# Altium project PMR_for_R124_test.PrjPcb (part 2 of 2)

## Sheet MCU.SchDoc
size A4; DocumentNumber: 6; SheetNumber: 6; SheetTotal: 7
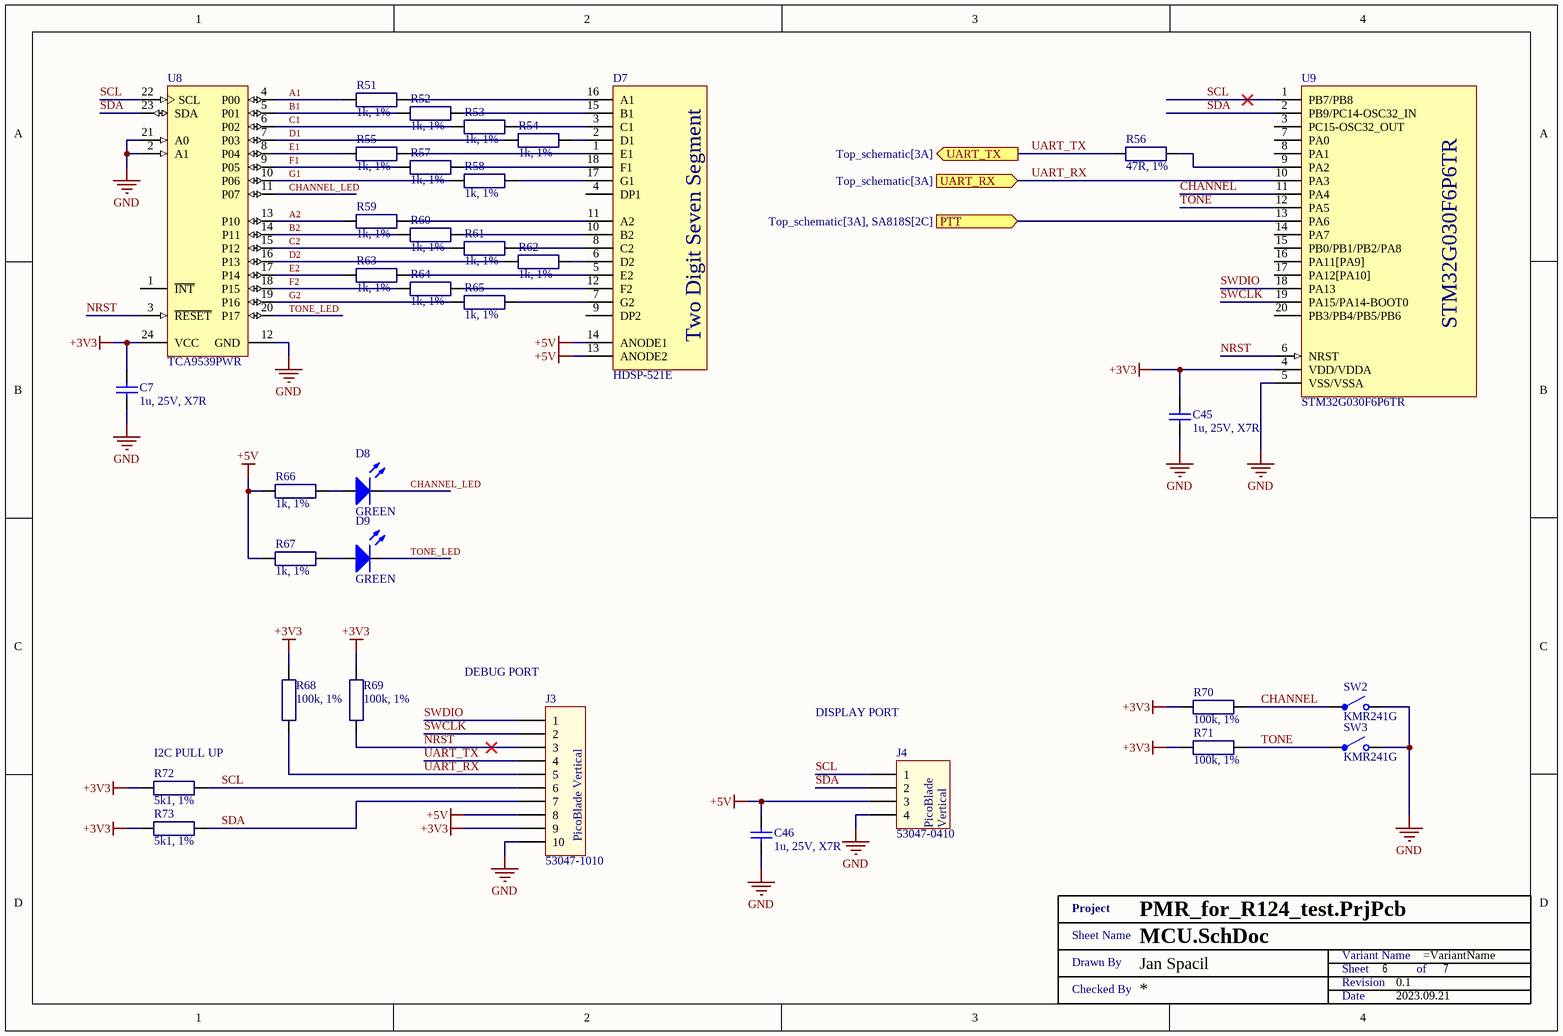
[diagram p3: MCU.SchDoc]

### Parts
(Parts that share a designator on the sheet are numbered #1, #2 ... from top to bottom, then left to right.)
C7  1u, 25V, X7R  [SMD0603]
C45  1u, 25V, X7R  [SMD0603]
C46  1u, 25V, X7R  [SMD0603]
D7  HDSP-521E  [HDSP-521E]
D8  GREEN  [MCL-S270]
D9  GREEN  [MCL-S270]
J3  53047-1010  [530471010]
J4  53047-0410  [530470410]
R51  1k, 1%  [SMD0603 - R]
R52  1k, 1%  [SMD0603 - R]
R53  1k, 1%  [SMD0603 - R]
R54  1k, 1%  [SMD0603 - R]
R55  1k, 1%  [SMD0603 - R]
R56  47R, 1%  [SMD0603 - R]
R57  1k, 1%  [SMD0603 - R]
R58  1k, 1%  [SMD0603 - R]
R59  1k, 1%  [SMD0603 - R]
R60  1k, 1%  [SMD0603 - R]
R61  1k, 1%  [SMD0603 - R]
R62  1k, 1%  [SMD0603 - R]
R63  1k, 1%  [SMD0603 - R]
R64  1k, 1%  [SMD0603 - R]
R65  1k, 1%  [SMD0603 - R]
R66  1k, 1%  [SMD0603 - R]
R67  1k, 1%  [SMD0603 - R]
R68  100k, 1%  [SMD0603 - R]
R69  100k, 1%  [SMD0603 - R]
R70  100k, 1%  [SMD0603 - R]
R71  100k, 1%  [SMD0603 - R]
R72  5k1, 1%  [SMD0603 - R]
R73  5k1, 1%  [SMD0603 - R]
SW2  KMR241G  [KMR2]
SW3  KMR241G  [KMR2]
U8  TCA9539PWR  [PW0024A_M]
U9  STM32G030F6P6TR  [TSSOP20]
XX?#4  Title 1  (value not drawn)  (graphical)

### Ports
PTT (in, see Top_schematic[3A], SA818S[2C]), UART_RX (in, see Top_schematic[3A]), UART_TX (out, see Top_schematic[3A])

### Nets
+3V3: C7.1 C45.1 J3.9 R68.2 R69.2 R70.2 R71.2 R72.2 R73.2 U8.24(VCC) U9.4(VDD/VDDA)
+5V: C46.1 D7.13(ANODE2) D7.14(ANODE1) J3.8 J4.3 R66.1 R67.1
GND: C7.2 C45.2 C46.2 J3.10 J4.4 SW2.2 SW3.2 U8.2(A1) U8.12(GND) U8.21(A0) U9.5(VSS/VSSA)
A1: R51.2 U8.4(P00)
A2: R59.2 U8.13(P10)
B1: R52.2 U8.5(P01)
B2: R60.2 U8.14(P11)
C1: R53.2 U8.6(P02)
C2: R61.2 U8.15(P12)
CHANNEL: R70.1 SW2.1 U9.11(PA4)
CHANNEL_LED: D8.2(K) U8.11(P07)
D1: R54.2 U8.7(P03)
D2: R62.2 U8.16(P13)
E1: R55.2 U8.8(P04)
E2: R63.2 U8.17(P14)
F1: R57.2 U8.9(P05)
F2: R64.2 U8.18(P15)
G1: R58.2 U8.10(P06)
G2: R65.2 U8.19(P16)
NRST: J3.3 R69.1 U8.3(~{RESET}) U9.6(NRST)
PTT: U9.13(PA6) ; port PTT
SCL: J3.6 J4.1 R72.1 U8.22(SCL) U9.1(PB7/PB8)
SDA: J3.7 J4.2 R73.1 U8.23(SDA) U9.2(PB9/PC14-OSC32_IN)
SWCLK: J3.2 U9.19(PA15/PA14-BOOT0)
SWDIO: J3.1 U9.18(PA13)
TONE: R71.1 SW3.1 U9.12(PA5)
TONE_LED: D9.2(K) U8.20(P17)
UART_RX: J3.5 R68.1 U9.10(PA3) ; port UART_RX
UART_TX: J3.4 R56.1 ; port UART_TX
NetD7_1: D7.1(E1) R55.1
NetD7_2: D7.2(D1) R54.1
NetD7_3: D7.3(C1) R53.1
NetD7_5: D7.5(E2) R63.1
NetD7_6: D7.6(D2) R62.1
NetD7_7: D7.7(G2) R65.1
NetD7_8: D7.8(C2) R61.1
NetD7_10: D7.10(B2) R60.1
NetD7_11: D7.11(A2) R59.1
NetD7_12: D7.12(F2) R64.1
NetD7_15: D7.15(B1) R52.1
NetD7_16: D7.16(A1) R51.1
NetD7_17: D7.17(G1) R58.1
NetD7_18: D7.18(F1) R57.1
NetD8_1: D8.1(A) R66.2
NetD9_1: D9.1(A) R67.2
NetR56_2: R56.2 U9.9(PA2)

Not connected (* = marked no-connect by the designer): D7 4(DP1) 9(DP2); U8 1(~{INT}); U9 3(PC15-OSC32_OUT) 7(PA0) 8(PA1) 14(PA7) 15(PB0/PB1/PB2/PA8) 16(PA11[PA9]) 17(PA12[PA10]) 20(PB3/PB4/PB5/PB6)

### Notes on the sheet
- (near J3) DEBUG PORT
- DISPLAY PORT
- (near R72) I2C PULL UP
- (in symbol 53047-0410) PicoBlade; Vertical
- (in symbol 53047-1010) PicoBlade Vertical
- (in symbol HDSP-521E) Two Digit Seven Segment
- (in symbol Title 1) Project; Sheet Name; Variant Name; Drawn By; Sheet; of; Revision; Checked By; Date

### Library data of the parts
C7 C45 C46 = CGA3E1X7R1E105K080AC: CAP CER 1UF 25V X7R 0603; Manufacturer: TDK Corporation; Tolerance: ±10%; Manufacturer Part Number: CGA3E1X7R1E105K080AC; RoHS: RoHS Compliant; Category: Capacitors; Stock 1: 109509; Pricing 1: 1=0.2, 10=0.135, 100=0.0686, 500=0.04696, 1000=0.04154 (USD); Packaging: Cut Tape (CT); Part Status: Active; Voltage - Rated: 25V; Temperature Coefficient: X7R; Operating Temperature: -55°C ~ 125°C; Features: -; Ratings: AEC-Q200; Applications: Automotive; Failure Rate: -; Mounting Type: Surface Mount, MLCC; Package / Case: 0603 (1608 Metric); Size / Dimension: 0.063" L x 0.032" W (1.60mm x 0.80mm); Height - Seated (Max): -; Thickness (Max): 0.035" (0.90mm); Lead Spacing: -; Lead Style: -; ComponentLink1URL: https://product.tdk.com/info/en/catalog/datasheets/mlcc_automotive_general_en.pdf; ComponentLink1Description: https://product.tdk.com/info/en/catalog/datasheets/mlcc_automotive_general_en.pdf; Capacitance: 1u; Supplier 1: Mouser; Supplier Part Number 1: 810-CGA3E1X7R1E105K; Supplier 2: Farnell; Supplier Part Number 2: 2346962; Supplier 3: Digi-Key; Supplier Part Number 3: 445-6931-1-ND
D7 = HDSP-521E: Displays Segmented Panel 2DIGIT 16LED Hi-Eff. Red CA 18-Pin DIP Tube; Manufacturer: Broadcom Avago; Forward Voltage: 2.05V; Luminous Intensity: 4mcd; Max Power Dissipation: 62.5mW; Forward Current: 20mA; Number of Characters: 2; Test Current: 10mA; Element Configuration: Common Anode; Wavelength: 628nm; Character Height: 18.6mm; Number of Elements: 16; Number of Segments: 14; Character Width: 7.8mm; Reverse Voltage: 5V; Viewing Area (height): 14.22mm; Supplier 1: Mouser; Supplier Part Number 1: 630-HDSP-521E; Manufacturer Part Number: HDSP-521E; RoHS: Yes; Category: LED Displays; Stock 1: 3408; Pricing 1: 1=2.84000, 10=1.90000, 50=1.90000, 100=1.47000, 1000=1.12000, 10000=1.09000 (USD); Mount: Through Hole; Case/Package: DIP; Number of Pins: 18; Color: Red; Min Operating Temperature: -35°C; Max Operating Temperature: 85°C; Packaging: Rail/Tube; Number of Positions: 2; Package Quantity: 200; Illumination Color: Red; Operating Supply Voltage: 2.05V; Power Consumption: 62.5mW; Dominant Wavelength: 628nm; Power Dissipation: 62.5mW; Series: -; Display Type: Segment; Length: 25mm; Width: 0.984inch; Height: 0.732inch; Depth: 18.6mm; Viewing Area Length: 7.8mm; Radiation Hardening: No; REACH SVHC: No SVHC; Lead Free: Lead Free; RoHS Compliant: Yes; Supplier 2: Farnell; Supplier Part Number 2: 1003314; Supplier 3: Digi-Key; Supplier Part Number 3: 516-1206-5-ND; Supplier 4: RSComponents; Supplier Part Number 4: 8305126
D8 D9 = MCL-S270GC: MULTICOMP - MCL-S270GC - LED, 0805, GREEN, 10MCD, 570NM; LED Mounting: SMD; Bulb Size: 1.25mm x 1.4; Forward Current If: 20; Forward Voltage: 2.1; Wavelength Typ: 570; Luminous Intensity: 10; Viewing Angle: 140°; Lens Shape: Rectangular; SVHC: No SVHC (17-Dec-2015); Forward Voltage VF Max: 2.6; LED / Lamp Size: 1.4mm x 1.25; LED Type: Standard; Luminous Intensity Max: 16; Luminous Intensity Min: 4.5; No. of Pins: 2; Peak Forward Current: 100; Peak Wavelength: 568; Reverse Protection Voltage: 5; Voltage Vf Min: 1.7; Voltage Vf Typ: 2.1V<!--FANDB--><div class="features-and-benefits-container"><div class="features-and-benefits-description"><span class="features-benefits-value">The MCL-S270GC is a green SMD LED made of GaP dice. This LED offers water clear rectangular lens and 260°C for 5 seconds lead soldering temperature range 1.6mm from body.</span></div><div class="features-and-benefits-list"><ul class="features-and-benefits-list-list"><li class="features-and-benefits-list-item">-40 to 85; Manufacturer: MULTICOMP; Manufacturer Part Number: MCL-S270GC; RoHS: YES; Stock 1: 80989; Pricing 1: 5=0,145, 25=0,136, 100=0,126, 250=0,0813, 500=0,0645, 2000=0,0559, 5000=0,0496, 20000=0,0434 (GBP); LED Colour: Green; Packaging: Cut Tape; Product Range: -; Automotive Qualification Standard: -; MSL: MSL 3 - 168 hours; Current Rating: 20; Dominant Wavelength: 570; Dominant Wavelength Typ: 570; Forward Current If Max: 20; Luminous Intensity Typ: 10; Operating Temperature Max: 85; Operating Temperature Min: -40; Operating Temperature Range: -40°C to +85; Storage Temperature Max: +100; Storage Temperature Min: -40; ComponentLink1URL: http://www.farnell.com/cad/53028.pdf; ComponentLink1Description: http://www.farnell.com/cad/53028.pdf; ComponentLink2URL: http://www.farnell.com/datasheets/1671537.pdf; ComponentLink2Description: http://www.farnell.com/datasheets/1671537.pdf; Supplier 1: Farnell; Supplier Part Number 1: 1581242; Supplier 2: Newark; Supplier Part Number 2: 14N9356
J3 = 53047-1010: 1.25mm Pitch, PicoBlade PCB Header, Single Row, Vertical, Through Hole, Tin Plating, Friction Lock, 10 Circuits, Tray, 2.30mm PC Tail Length; Manufacturer: Molex; Number of Contacts: 10; Max Voltage Rating (DC): 125.125kV; Max Voltage Rating (AC): 125V; Current Rating: 1A; Contact Resistance: 20MR; Insulation Resistance: 100MR; Glow Wire Compliant: Non-compliant; Connector Type: Blade Pin; Supplier 1: Mouser; Supplier Part Number 1: 538-53047-1010; Manufacturer Part Number: 53047-1010; Stock 1: 9729; Pricing 1: 1 = 0.50000, 10 = 0.48800, 50 = 0.48800, 100 = 0.37400, 1000 = 0.26800, 10000 = 0.21600 (USD); RoHS: Yes; Mount: Through Hole; Contact Plating: Tin; Contact Material: Bronze; Housing Color: White; Color: Natural; Housing Material: Nylon; Body Plating: Tin; Plating: Tin; Min Operating Temperature: -40°C; Max Operating Temperature: 85°C; Termination: Solder; Number of Rows: 1; Orientation: Vertical; Packaging: Tray; Number of Positions: 10; Package Quantity: 2000; Voltage Rating: 125V; Max Current Rating: 1A; Number of Poles: 10; Voltage Rating (AC): 125V; Contact Gender: Male; Working Voltage: 125V; Current: 1A; Voltage: 125V; Number of Circuits: 10; Voltage Rating (DC): 125V; Length: 14.25mm; Height: 4.2mm; Pitch: 1.25mm; Depth: 3.2mm; Lead Pitch: 1.25mm; Radiation Hardening: No; REACH SVHC: Unknown; Lead Free: Lead Free; Flammability Rating: UL94 V-0; ComponentLink1URL: https://datasheet.ciiva.com/5151/0530471010-pcb-headers-171035-5151940.pdf?src-supplier=Mouser; ComponentLink1Description: https://datasheet.ciiva.com/5151/0530471010-pcb-headers-171035-5151940.pdf?src-supplier=Mouser; ComponentLink2URL: https://datasheet.ciiva.com/30250/7280530471010-pcb-headers-30250345.pdf?src-supplier=Onlinecomponents.com; ComponentLink2Description: https://datasheet.ciiva.com/30250/7280530471010-pcb-headers-30250345.pdf?src-supplier=Onlinecomponents.com; ComponentLink3URL: https://datasheet.ciiva.com/11747/0900766b8024e2fd-11747087.pdf?src-supplier=RSComponents; ComponentLink3Description: https://datasheet.ciiva.com/11747/0900766b8024e2fd-11747087.pdf?src-supplier=RSComponents; ComponentLink4URL: https://datasheet.ciiva.com/19461/2033252-19461670.pdf?src-supplier=Jameco; ComponentLink4Description: https://datasheet.ciiva.com/19461/2033252-19461670.pdf?src-supplier=Jameco; ComponentLink5URL: https://datasheet.ciiva.com/10083/0530471010-pcb-headers-10083962.pdf?src-supplier=Avnet; ComponentLink5Description: https://datasheet.ciiva.com/10083/0530471010-pcb-headers-10083962.pdf?src-supplier=Avnet; ComponentLink6URL: https://datasheet.ciiva.com/20207/22-3930e-20207531.pdf?src-supplier=Rapid+Electronics; ComponentLink6Description: https://datasheet.ciiva.com/20207/22-3930e-20207531.pdf?src-supplier=Rapid+Electronics; Supplier 2: Arrow; Supplier Part Number 2: 53047-1010; Stock 2: 19420; Pricing 2: 1 = 0.41890, 10 = 0.39900, 100 = 0.30530, 500 = 0.27600, 1000 = 0.24010, 8000 = 0.20770, 1 = 0.56870, 10 = 0.52970, 100 = 0.36620, 500 = 0.31550, 1000 = 0.26830, 100 = 0.37250 (USD); Supplier 3: Digi-Key; Supplier Part Number 3: WM1739-ND; Stock 3: 4931; Pricing 3: 1 = 0.52000, 10 = 0.48900, 100 = 0.37470, 500 = 0.32580, 1000 = 0.26879, 8000 = 0.21992, 16000 = 0.21666 (USD); Supplier 4: Farnell; Supplier Part Number 4: 9733086; Stock 4: 12753; Supplier 5: Mouser; Supplier Part Number 5: 538-53047-0410; Category: Headers and Wire Housings; Stock 5: 7971; Pricing 5: 1=0,27000, 10=0,23400, 100=0,18000, 500=0,15400, 1000=0,13000, 5000=0,11200, 10000=0,10400 (USD); Contact Mating Length: 0.089inch; ComponentLink7URL: https://datasheet.ciiva.com/3934/87920530470410-pcb-headers-3934064.pdf?src-supplier=Arrow; ComponentLink7Description: https://datasheet.ciiva.com/3934/87920530470410-pcb-headers-3934064.pdf?src-supplier=Arrow
J4 = 53047-0410: 1.25mm Pitch, PicoBlade PCB Header, Single Row, Vertical, Through Hole, Tin Plating, Friction Lock, 4 Circuits, Tray, 2.30mm PC Tail Length; Manufacturer: Molex; Manufacturer Part Number: 0530470410; Number of Positions: 4; Max Voltage Rating (AC): 125V; Contact Resistance: 20mR; Connector Type: Blade Pin; RoHS: Yes; Category: Headers and Wire Housings; Stock 4: 7971; Pricing 4: 1=0,27000, 10=0,23400, 100=0,18000, 500=0,15400, 1000=0,13000, 5000=0,11200, 10000=0,10400 (USD); Mount: Through Hole; Housing Material: Nylon; Contact Plating: Tin; Contact Material: Bronze; Color: Natural; Housing Color: White; Min Operating Temperature: -40°C; Max Operating Temperature: 85°C; Termination: Solder; Number of Contacts: 4; Packaging: Tray; Number of Rows: 1; Orientation: Straight; Length: 6.75mm; Pitch: 1.25mm; Contact Mating Length: 0.089inch; Depth: 3.2mm; ComponentLink1URL: https://datasheet.ciiva.com/3934/87920530470410-pcb-headers-3934064.pdf?src-supplier=Arrow; ComponentLink1Description: https://datasheet.ciiva.com/3934/87920530470410-pcb-headers-3934064.pdf?src-supplier=Arrow; Supplier 1: Mouser; Supplier Part Number 1: 538-53047-0410; Supplier 2: Farnell; Supplier Part Number 2: 9733060; Supplier 3: Digi-Key; Supplier Part Number 3: WM1733-ND; Supplier 4: Avnet; Supplier Part Number 4: 0530470410
R51-R55 R57-R67 = MCWR06X1001FTL: MULTICOMP - MCWR06X1001FTL - RES, THICK FILM, 1K, 1%, 0.1W, 0603; Voltage Rating: 50; Resistor Case Style: 0603 [1608 Metric]; Power Rating: 100; Product Range: MCWR Series; Temperature Coefficient: ± 100; SVHC: No SVHC (07-Jul-2017)<!--FANDB--><div class="features-and-benefits-container"><div class="features-and-benefits-desc-container"><span class="features-and-benefits-container-desc">SMD Chip Resistor, Thick Film, 1 kohm, 50 V, 0603 [1608 Metric], 100 mW, ± 1; Manufacturer: MULTICOMP; Manufacturer Part Number: MCWR06X1001FTL; RoHS: Y-EX; Stock 1: 134740; Pricing 1: 10=0.0037, 100=0.0022, 500=0.0016, 1000=0.0012, 2500=0.001 (GBP); Resistance: 1k; Resistance Tolerance: ± 1%; Packaging: Cut Tape; Resistor Element Material: Thick Film; Automotive Qualification Standard: -; ComponentLink1URL: http://www.farnell.com/datasheets/1849611.pdf; ComponentLink1Description: http://www.farnell.com/datasheets/1849611.pdf; Supplier 1: Farnell; Supplier Part Number 1: 2447272; Supplier 2: Newark; Supplier Part Number 2: 94X1378
R56 = RC0603FR-0747RL: YAGEO - RC0603FR-0747RL - Surface Mount Chip Resistor, Thick Film, RC Series, 47 ohm, 100 mW, 1%, 50 V, 0603 [1608 Metric] RoHS Compliant: Yes; Power Rating: 100mW; Voltage Rating (DC): 50V; Temperature Coefficient: 100ppm/°C; Voltage Rating: 75V; Supplier 1: Mouser; Supplier Part Number 1: 603-RC0603FR-0747RL; Manufacturer: Yageo; Manufacturer Part Number: RC0603FR-0747RL; RoHS: Yes; Category: Chip SMD Resistors; Stock 1: 314282; Pricing 1: 1=0.10000, 10=0.01800, 100=0.00600, 1000=0.00500, 5000=0.00300, 10000=0.00300 (USD); Case/Package: 0603; Number of Pins: 2; Weight: 7.1E-05oz; Case Code (Imperial): 0603; Case Code (Metric): 1608; Min Operating Temperature: -55°C; Max Operating Temperature: 155°C; Resistance: 47R; Tolerance: 1%; Packaging: Tape and Reel; Package Quantity: 1; Termination: SMD/SMT; Resistor Type: Thick Film; Number of Terminations: 2; Max Power Dissipation: 100mW; Features: Moisture Resistant; Length: 1.6mm; Height: 0.45mm; Width: 0.8mm; Depth: 0.8mm; REACH SVHC: Unknown; Lead Free: Lead Free; Military Standard: Not; ComponentLink1URL: https://datasheet.ciiva.com/2453/pyu-r-int-thick-7-2453922.pdf?src-supplier=Digi-Key; ComponentLink1Description: https://datasheet.ciiva.com/2453/pyu-r-int-thick-7-2453922.pdf?src-supplier=Digi-Key; ComponentLink2URL: https://datasheet.ciiva.com/2453/pyu-r-int-thick-7-2453923.pdf?src-supplier=Digi-Key; ComponentLink2Description: https://datasheet.ciiva.com/2453/pyu-r-int-thick-7-2453923.pdf?src-supplier=Digi-Key; ComponentLink3URL: https://datasheet.ciiva.com/2453/pyu-r-int-thick-7-2453924.pdf?src-supplier=Digi-Key; ComponentLink3Description: https://datasheet.ciiva.com/2453/pyu-r-int-thick-7-2453924.pdf?src-supplier=Digi-Key; ComponentLink4URL: https://datasheet.ciiva.com/7746/443971-7746363.pdf?src-supplier=Element14; ComponentLink4Description: https://datasheet.ciiva.com/7746/443971-7746363.pdf?src-supplier=Element14; ComponentLink5URL: https://datasheet.ciiva.com/7746/443971-7746364.pdf?src-supplier=Element14; ComponentLink5Description: https://datasheet.ciiva.com/7746/443971-7746364.pdf?src-supplier=Element14; ComponentLink6URL: https://datasheet.ciiva.com/46440/1868787-46440908.pdf?src-supplier=Element14; ComponentLink6Description: https://datasheet.ciiva.com/46440/1868787-46440908.pdf?src-supplier=Element14; Supplier 2: Farnell; Supplier Part Number 2: 9238328; Supplier 3: Digi-Key; Supplier Part Number 3: 311-47.0HRCT-ND
R68-R71 = RC0603FR-07100KL: RES SMD 100K OHM 1% 1/10W 0603; Manufacturer: Yageo; Power (Watts): 0.1W, 1/10W; Temperature Coefficient: ±100ppm/°C; Manufacturer Part Number: RC0603FR-07100KL; RoHS: RoHS Compliant; Category: Resistors; Stock 1: 14618646; Pricing 1: 1=0.1, 10=0.015, 100=0.006, 1000=0.00268, 2500=0.00233 (USD); Packaging: Cut Tape (CT); Part Status: Active; Tolerance: ±1%; Composition: Thick Film; Features: Moisture Resistant; Operating Temperature: -55°C ~ 155°C; Package / Case: 0603 (1608 Metric); Supplier Device Package: 0603; Size / Dimension: 0.063" L x 0.032" W (1.60mm x 0.80mm); Height - Seated (Max): 0.022" (0.55mm); Failure Rate: -; ComponentLink1URL: http://www.yageo.com/documents/recent/PYu-RC_Group_51_RoHS_L_8.pdf; ComponentLink1Description: http://www.yageo.com/documents/recent/PYu-RC_Group_51_RoHS_L_8.pdf; Resistance: 100k; Supplier 1: Mouser; Supplier Part Number 1: 603-RC0603FR-07100KL; Supplier 2: Farnell; Supplier Part Number 2: 9238727; Supplier 3: Digi-Key; Supplier Part Number 3: 311-100KHRCT-ND
R72 R73 = RC0603FR-075K1L: RES SMD 5.1K OHM 1% 1/10W 0603; Manufacturer: Yageo; Power Rating: 100mW; Temperature Coefficient: 100ppm/°C; Voltage Rating: 50V; Supplier 1: Mouser; Supplier Part Number 1: 603-RC0603FR-075K1L; Manufacturer Part Number: RC0603FR-075K1L; RoHS: Yes; Category: Chip SMD Resistors; Stock 1: 489882; Pricing 1: 1=0,10000, 10=0,01800, 50=0,01800, 100=0,00600, 1000=0,00500, 10000=0,00300 (USD); Case/Package: 0603; Number of Pins: 2; Case Code (Imperial): 0603; Case Code (Metric): 1608; Size Code: 0603; Min Operating Temperature: -55°C; Max Operating Temperature: 155°C; Tolerance: 1%; Series: RC; Resistance: 5k1; Packaging: Tape and Reel; Package Quantity: 1; Termination: SMD/SMT; Resistor Type: Thick Film; Number of Terminations: 2; Max Power Dissipation: 100mW; Voltage Rating (DC): 50V; Features: Moisture Resistant; Resistance Tolerance: 1%; Construction: Rectangular; Length: 0.063inch; Width: 0.031inch; Height: 0.022inch; Depth: 0.8mm; RoHS Compliant: Yes; REACH SVHC: No SVHC; Military Standard: Not; Lead Free: Lead Free; ComponentLink1URL: https://datasheet.ciiva.com/46395/443971-46395016.pdf?src-supplier=Element14; ComponentLink1Description: https://datasheet.ciiva.com/46395/443971-46395016.pdf?src-supplier=Element14; ComponentLink2URL: https://datasheet.ciiva.com/15189/getdatasheetpartid-326732-15189786.pdf?src-supplier=Verical; ComponentLink2Description: https://datasheet.ciiva.com/15189/getdatasheetpartid-326732-15189786.pdf?src-supplier=Verical; ComponentLink3URL: https://datasheet.ciiva.com/2454/pyu-r-int-thick-7-2454045.pdf?src-supplier=Digi-Key; ComponentLink3Description: https://datasheet.ciiva.com/2454/pyu-r-int-thick-7-2454045.pdf?src-supplier=Digi-Key; ComponentLink4URL: https://datasheet.ciiva.com/2454/pyu-r-int-thick-7-2454046.pdf?src-supplier=Digi-Key; ComponentLink4Description: https://datasheet.ciiva.com/2454/pyu-r-int-thick-7-2454046.pdf?src-supplier=Digi-Key; ComponentLink5URL: https://datasheet.ciiva.com/2454/pyu-r-int-thick-7-2454047.pdf?src-supplier=Digi-Key; ComponentLink5Description: https://datasheet.ciiva.com/2454/pyu-r-int-thick-7-2454047.pdf?src-supplier=Digi-Key; Supplier 2: Farnell; Supplier Part Number 2: 3495881; Supplier 3: Digi-Key; Supplier Part Number 3: 311-5.10KHRCT-ND
SW2 SW3 = KMR241G LFS: C & K COMPONENTS - KMR241G LFS - SWITCH, SMD, 4N, 0.05A, 32VDC, SPST-NO; Illumination: Non Illuminated; Contact Voltage DC Nom: 32; Contact Current Max: 50; Operating Force: 4; Switch Terminals: Solder; SVHC: No SVHC (17-Dec-2015); Actuation Type: Top; Actuator / Cap Colour: Black; Contact Resistance: 100; External Depth: 2.8; External Length / Height: 1.9; External Width: 4.6; Power Rating: 1VA<!--FANDB--><div class="features-and-benefits-container"><div class="features-and-benefits-description"><span class="features-benefits-value">The KMR241G LFS is a micro-miniature SMD Tactile Switch with momentary action and SPST-NO contact arrangement. It has silver-plated gull-wing terminals and grounding pin.</span></div><div class="features-and-benefits-list"><ul class="features-and-benefits-list-list"><li class="features-and-benefits-list-item">Top actuated</li><li class="features-and-benefits-list-item">Excellent tactile feel</li><li class="features-and-benefits-list-item">Ultra low current capabilities</li><li class="features-and-benefits-list-item">300000-cycle Operating life</li><li class="features-and-benefits-list-item">IP40 Protection rating</li></ul></div><div class="features-and-benefits-applications"><ul class="features-and-benefits-value"><li class="features-and-benefits-list-item">Automotive</li><li class="features-and-benefits-list-item">Industrial</li><li class="features-and-benefits-list-item">Medical</li><li class="features-and-benefits-list-item">Portable Devices</li></ul></div></div>; Manufacturer: C & K COMPONENTS; Manufacturer Part Number: KMR241G LFS; RoHS: YES; Stock 1: 40256; Pricing 1: 1=0.384, 50=0.37, 100=0.218, 7000=0.185, 20000=0.181, 30000=0.178, 50000=0.174 (GBP); Product Range: -; Contact Configuration: SPST-NO; Operating Temperature Max: 85; Operating Temperature Min: -40; ComponentLink1URL: http://www.farnell.com/datasheets/1702857.pdf; ComponentLink1Description: http://www.farnell.com/datasheets/1702857.pdf; Supplier 1: Mouser; Supplier Part Number 1: 611-KMR241GLFS; Supplier 2: Farnell; Supplier Part Number 2: 1437637; Supplier 3: Digi-Key; Supplier Part Number 3: CKN10248DKR-ND
U8 = CMP-0314-00251-2: Remote 16-Bit I2C and SMBus, Low-Power I/O Expander with Interrupt Output, Reset & Config. Register, 1.65 to 5.5 V, -40 to 85 degC, 24-pin TSSOP (PW), Green (RoHS & no Sb/Br); Manufacturer: Texas Instruments; Interrupt Output: Yes; SubFamily: I2C IO Expander; I2C Address: 1110 1xx; # of I/Os: 16; Max Frequency(kHz): 400; 5V Tolerant I/O: Yes; ComponentLink1Description: Datasheet; PartNumber: TCA9539PWR; Eco-Plan: Green (RoHS & no Sb/Br); Reset Input: Yes; ComponentLink2Description: Package Specification; Mounting Technology: Surface Mount; PackageReference: PW0024A; DatasheetVersion: SCPS202A; ComponentLink1URL: http://www.ti.com/general/docs/lit/getliterature.tsp?genericPartNumber=TCA9539&fileType=pdf; Vcc range(V): 1.65 to 5.5; Low Power: Yes; Code_JEDEC: MO-153; Configuration Registers: Yes; PackageVersion: revG, Feb-2011; PackageDescription: 24-Pin Thin Small Outline Package 0.65 mm Pitch; Push-Pull I/O Type: Yes; ComponentLink2URL: http://www.ti.com/litv/pdf/mpds177g
U9 = STM32G030F6P6TR: MCU 32-Bit STM32 ARM Cortex-M0+ RISC 32KB Flash 2V to 3.6V 20-Pin TSSOP T/R; Manufacturer: STMicroelectronics; Supplier 1: Mouser; Supplier Part Number 1: 511-STM32G030F6P6TR; Manufacturer Part Number: STM32G030F6P6TR; RoHS: Yes; Category: Microcontrollers; Stock 1: 3310; Pricing 1: 1=1.84000, 10=1.66000, 50=1.66000, 100=1.29000, 250=1.21000, 500=1.07000, 1000=0.84100, 2500=0.78400, 5000=0.74700, 10000=0.74700 (USD); Supplier 2: Digi-Key; Supplier Part Number 2: 497-STM32G030F6P6TRCT-ND

## Sheet Interfaces.SchDoc
size A4; DocumentNumber: 7; SheetNumber: 7; SheetTotal: 7
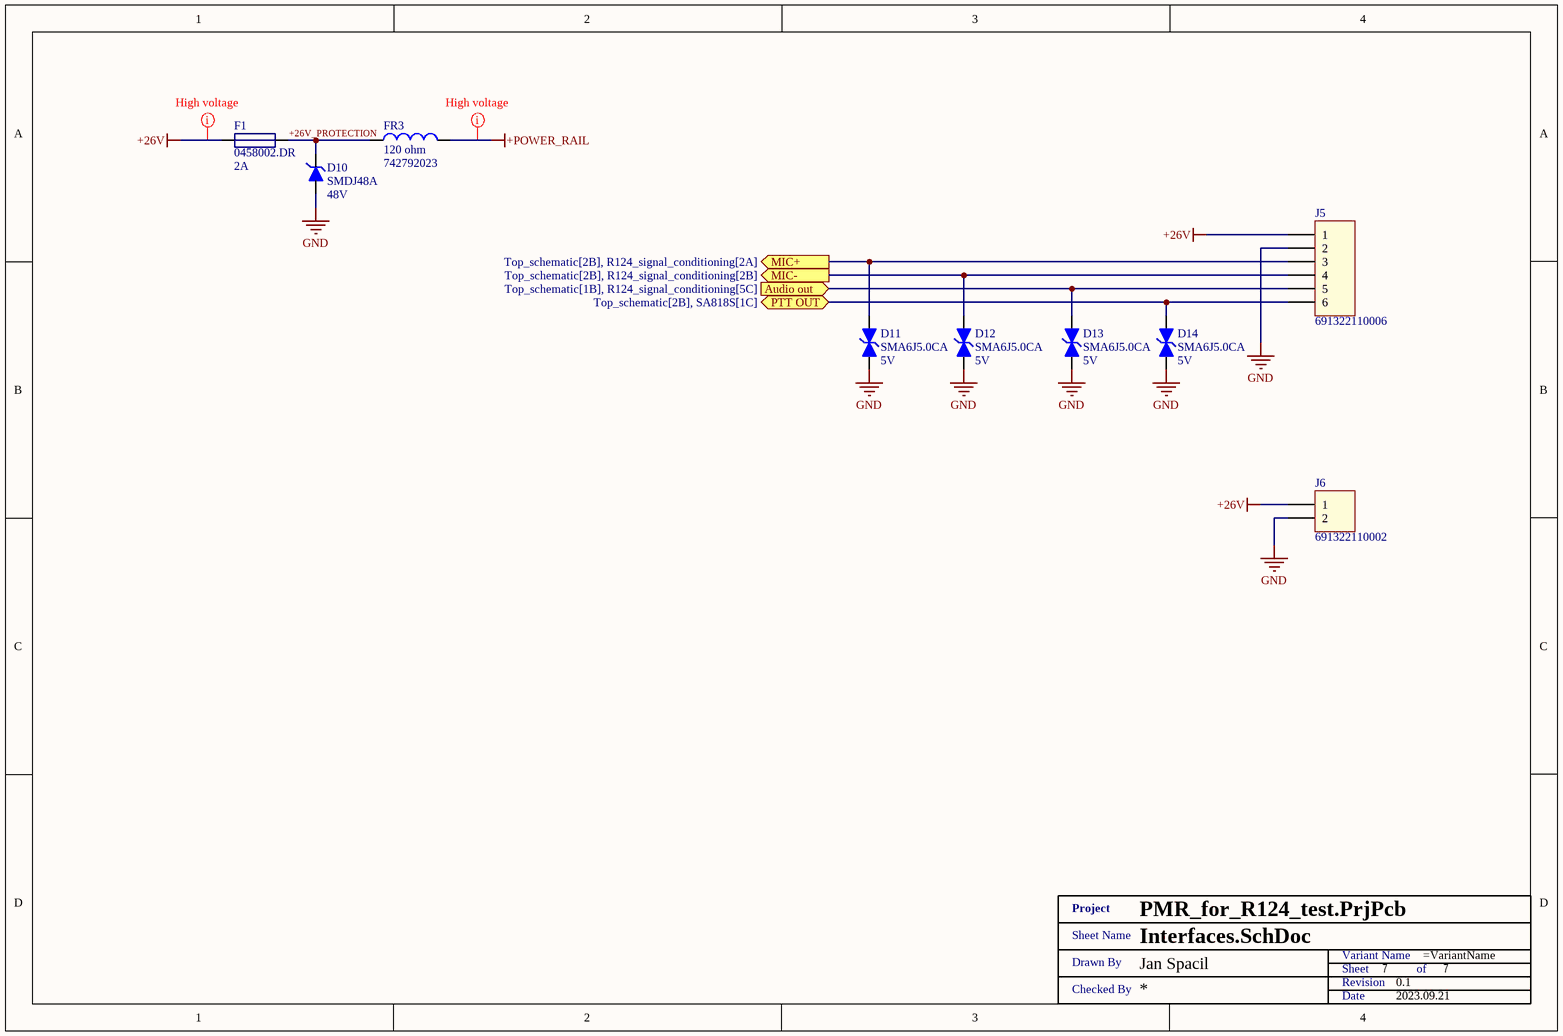
[diagram p4: Interfaces.SchDoc]

### Parts
(Parts that share a designator on the sheet are numbered #1, #2 ... from top to bottom, then left to right.)
D10  SMDJ48A  Reverse Standoff Voltage: 48V  [DO-214AB]
D11  SMA6J5.0CA  Reverse Standoff Voltage: 5V  [DO-214AC]
D12  SMA6J5.0CA  Reverse Standoff Voltage: 5V  [DO-214AC]
D13  SMA6J5.0CA  Reverse Standoff Voltage: 5V  [DO-214AC]
D14  SMA6J5.0CA  Reverse Standoff Voltage: 5V  [DO-214AC]
F1  0458002.DR  Current Rating: 2A  [SMD1206 - FUSE]
FR3  120 ohm  [SMD0805 - R]
J5  691322110006  [691322110006]
J6  691322110002  [691322110002]
XX?#5  Title 1  (value not drawn)  (graphical)

### Ports
Audio out (in, see Top_schematic[1B], R124_signal_conditioning[5C]), MIC+ (out, see Top_schematic[2B], R124_signal_conditioning[2A]), MIC- (out, see Top_schematic[2B], R124_signal_conditioning[2B]), PTT OUT (bidir, see Top_schematic[2B], SA818S[1C])

### Nets
+26V: F1.1 J5.1 J6.1
+POWER_RAIL: FR3.2
GND: D10.2 D11.1(A) D12.1(A) D13.1(A) D14.1(A) J5.2 J6.2
+26V_PROTECTION: D10.1 F1.2 FR3.1
AUDIO OUT: D13.2(K) J5.5 ; port Audio out
MIC+: D11.2(K) J5.3 ; port MIC+
MIC-: D12.2(K) J5.4 ; port MIC-
PTT OUT: D14.2(K) J5.6 ; port PTT OUT

### Layout directives
net class HV: +26V, +POWER_RAIL

### Notes on the sheet
- (in symbol Title 1) Project; Sheet Name; Variant Name; Drawn By; Sheet; of; Revision; Checked By; Date

### Library data of the parts
D10 = SMDJ48A: J Series 53.3 V 3000 W Surface Mount Uni-Directional TVS Diode - DO-214AB; Manufacturer: Littelfuse; Supplier 1: Mouser; Supplier Part Number 1: 576-SMDJ48A; Manufacturer Part Number: SMDJ48A; RoHS: Yes; Category: TVS Diodes; Stock 1: 11613; Pricing 1: 1=1.02, 10=0.889, 50=0.889, 100=0.688, 1000=0.471, 10000=0.408 (USD); ComponentLink1URL: https://datasheet.ciiva.com/16487/littelfuse-tvs-diodes-smdj-16487926.pdf?src-supplier=Future+Electronics; ComponentLink1Description: https://datasheet.ciiva.com/16487/littelfuse-tvs-diodes-smdj-16487926.pdf?src-supplier=Future+Electronics; ComponentLink2URL: https://datasheet.ciiva.com/332/littelfuse-tvs-diode-smdj-datasheet-pdf-332813.pdf?src-supplier=Digi-Key; ComponentLink2Description: https://datasheet.ciiva.com/332/littelfuse-tvs-diode-smdj-datasheet-pdf-332813.pdf?src-supplier=Digi-Key; ComponentLink3URL: https://datasheet.ciiva.com/332/littelfuse-tvs-diode-smdj-datasheet-pdf-332814.pdf?src-supplier=Digi-Key; ComponentLink3Description: https://datasheet.ciiva.com/332/littelfuse-tvs-diode-smdj-datasheet-pdf-332814.pdf?src-supplier=Digi-Key; ComponentLink4URL: https://datasheet.ciiva.com/332/littelfuse-tvs-diode-smdj-datasheet-pdf-332815.pdf?src-supplier=Digi-Key; ComponentLink4Description: https://datasheet.ciiva.com/332/littelfuse-tvs-diode-smdj-datasheet-pdf-332815.pdf?src-supplier=Digi-Key; Supplier 2: Farnell; Supplier Part Number 2: 2762843; Supplier 3: Digi-Key; Supplier Part Number 3: SMDJ48ACT-ND
D11-D14 = SMA6J5.0CA: ESD Suppressors / TVS Diodes 600W 5V 5% Bi-Directional; Manufacturer: Littelfuse; Supplier 1: Mouser; Supplier Part Number 1: 576-SMA6J5.0CA; Manufacturer Part Number: SMA6J5.0CA; RoHS: Yes; Category: TVS Diodes; Stock 1: 57321; Pricing 1: 1=0.41, 10=0.35, 50=0.35, 100=0.243, 1000=0.139, 10000=0.115 (USD); ComponentLink1URL: http://www.farnell.com/datasheets/2736094.pdf?src-supplier=Farnell; ComponentLink1Description: http://www.farnell.com/datasheets/2736094.pdf?src-supplier=Farnell; ComponentLink2URL: https://datasheet.octopart.com/SMA6J5.0CA-Littelfuse-datasheet-114785799.pdf?src-supplier=Future+Electronics; ComponentLink2Description: https://datasheet.octopart.com/SMA6J5.0CA-Littelfuse-datasheet-114785799.pdf?src-supplier=Future+Electronics; ComponentLink3URL: https://www.littelfuse.com/~/media/electronics/datasheets/tvs_diodes/littelfuse_tvs_diode_sma6j_datasheet.pdf.pdf?src-supplier=Digi-Key; ComponentLink3Description: https://www.littelfuse.com/~/media/electronics/datasheets/tvs_diodes/littelfuse_tvs_diode_sma6j_datasheet.pdf.pdf?src-supplier=Digi-Key; ComponentLink4URL: http://www.farnell.com/datasheets/2736094.pdf?src-supplier=Newark; ComponentLink4Description: http://www.farnell.com/datasheets/2736094.pdf?src-supplier=Newark; ComponentLink5URL: http://www.farnell.com/datasheets/2736094.pdf?src-supplier=Element14; ComponentLink5Description: http://www.farnell.com/datasheets/2736094.pdf?src-supplier=Element14; Supplier 2: Farnell; Supplier Part Number 2: 3010381; Supplier 3: Digi-Key; Supplier Part Number 3: 18-SMA6J5.0CACT-ND
F1 = 0458002.DR: FUSE BRD MNT 2A 48VAC 75VDC 1206; Manufacturer: Littelfuse; Body Material: Ceramic; Voltage Rating (AC): 48V; Voltage Rating (DC): 75V; Resistance: 69.5mR; DC Cold Resistance: 63.5mR; Fuse Type: Board Mount (Cartridge Style Excluded); Voltage Rating: 63V; Approvals: cULus; Supplier 1: Mouser; Supplier Part Number 1: 576-0458002.DR; Manufacturer Part Number: 0458002.DR; Stock 1: 11466; Pricing 1: 1 = 1.31000, 10 = 0.97500, 50 = 0.97500, 100 = 0.81200, 1000 = 0.67000, 10000 = 0.50800 (USD); RoHS: Yes; Mount: Surface Mount; Case/Package: 1206; Case Code (Metric): 3216; Case Code (Imperial): 1206; Housing Material: Ceramic; Min Operating Temperature: -55°C; Max Operating Temperature: 125°C; Packaging: Tape and Reel; Package Quantity: 1500; Fuse Current: 2A; Termination: SMD/SMT; Working Voltage: 63V; Length: 0.125inch; Height: 0.062inch; Width: 1.575mm; Depth: 1.58mm; REACH SVHC: No SVHC; Lead Free: Lead Free; ComponentLink1URL: https://datasheet.ciiva.com/1730/337915-1730544.pdf?src-supplier=Newark; ComponentLink1Description: https://datasheet.ciiva.com/1730/337915-1730544.pdf?src-supplier=Newark; ComponentLink2URL: https://datasheet.ciiva.com/299/littelfuse-fuse-458-series-299804.pdf?src-supplier=Digi-Key; ComponentLink2Description: https://datasheet.ciiva.com/299/littelfuse-fuse-458-series-299804.pdf?src-supplier=Digi-Key; ComponentLink3URL: https://datasheet.ciiva.com/299/littelfuse-fuse-458-series-299805.pdf?src-supplier=Digi-Key; ComponentLink3Description: https://datasheet.ciiva.com/299/littelfuse-fuse-458-series-299805.pdf?src-supplier=Digi-Key; ComponentLink4URL: https://datasheet.ciiva.com/299/littelfuse-fuse-458-series-299806.pdf?src-supplier=Digi-Key; ComponentLink4Description: https://datasheet.ciiva.com/299/littelfuse-fuse-458-series-299806.pdf?src-supplier=Digi-Key; Supplier 2: Farnell; Supplier Part Number 2: 1702533; Stock 2: 1620; Supplier 3: Digi-Key; Supplier Part Number 3: F2931CT-ND; Stock 3: 14221; Pricing 3: 1 = 1.43000, 5 = 1.38400, 10 = 1.29500, 50 = 1.07180, 100 = 0.89320, 250 = 0.87088, 500 = 0.73690 (USD)
FR3 = 742792023: WURTH ELEKTRONIK - 742792023 - FERRITE BEAD, 0.03OHM, 3A, 0805; Impedance @ 100MHz: 120; Ferrite Case Style: 0805 [2012 Metric]; DC Current Rating: 3; DC Resistance Max: 0.03; Impedance Tolerance: ± 25%; Ferrite Mounting: SMD; Resistance: 0.03ohm<!--FANDB--><div class="features-and-benefits-container"><div class="features-and-benefits-description"><span class="features-benefits-value">The 742792023 is a SMD EMI Suppression Ferrite Bead with 0805 case and reliable Ni-Sn electrodes. It can be put directly on the printed circuit board. It offers excellent anti-EMI properties and low DC resistance. Placed very close next to the interference source even with smallest size 0402, maximal impedance at 1000; Manufacturer: WURTH ELEKTRONIK; RoHS: YES; Stock 1: 4283; Pricing 1: 1=0,123, 50=0,112, 100=0,103, 500=0,0937, 1000=0,0877, 2000=0,0846 (GBP); Product Range: -; Automotive Qualification Standard: -; Packaging: Cut Tape; ComponentLink1URL: http://www.farnell.com/datasheets/1695980.pdf; ComponentLink1Description: http://www.farnell.com/datasheets/1695980.pdf; ComponentLink2URL: http://www.farnell.com/cad/1670054.zip; ComponentLink2Description: http://www.farnell.com/cad/1670054.zip; Supplier 1: Mouser; Supplier Part Number 1: 710-742792023; Supplier 2: Farnell; Supplier Part Number 2: 1635732; Supplier 3: Digi-Key; Supplier Part Number 3: 732-1613-1-ND; Manufacturer Part Number: 742792023
J5 = 691322110006: WR-TBL Serie 3221 - 3.50 mm Horizontal PCB Header, 06p; Pitch: 3.5 mm; Published Date: Jan 2017; Publisher: Wurth Elektronik; ComponentLink1Description: Manufacturer; ComponentLink1URL: http://www.we-online.de; ComponentLink2Description: Datasheet; ComponentLink2URL: http://katalog.we-online.de/em/datasheet/6913221100xx.pdf; Part Number: 691322110006; Pin Number: 06p; Supplier 1: Digi-Key; Supplier Part Number 1: 732-2773-ND; Supplier 2: Farnell; Supplier Part Number 2: 1841319
J6 = 691322110002: WR-TBL Serie 3221 - 3.50 mm Horizontal PCB Header, 02p; Pitch: 3.5 mm; Published Date: Jan 2017; Publisher: Wurth Elektronik; ComponentLink1Description: Manufacturer; ComponentLink1URL: http://www.we-online.de; ComponentLink2Description: Datasheet; ComponentLink2URL: http://katalog.we-online.de/em/datasheet/6913221100xx.pdf; Part Number: 691322110002; Pin Number: 02p; Supplier 1: Digi-Key; Supplier Part Number 1: 732-2769-ND; Supplier 2: Farnell; Supplier Part Number 2: 1841315; Supplier 3: Mouser; Supplier Part Number 3: 710-691322110002

## Nets that join several sheets
+3V3: SA818S (Q2.1 Q3.1 R31.1 R32.1), MCU (11 pins)
+5V: R124_signal_conditioning (C17.2 D1.3 R21.2 U3.8), SA818S (9 pins), MCU (7 pins)
GND: R124_signal_conditioning (21 pins), SA818S (6 pins), MCU (11 pins), Interfaces (7 pins)
AF OUT: R124_signal_conditioning (R24.1), SA818S (U4.3)
AUDIO OUT: R124_signal_conditioning (C15.2), Interfaces (D13.2 J5.5)
MIC OUT: R124_signal_conditioning (6 pins), SA818S (U4.18)
MIC+: R124_signal_conditioning (C4.2 R1.1 R9.2), Interfaces (D11.2 J5.3)
MIC-: R124_signal_conditioning (C4.1 R9.1 R16.1), Interfaces (D12.2 J5.4)
PTT: SA818S (Q1.2 R35.2 R36.1 U4.5), MCU (U9.13)
PTT OUT: SA818S (R37.2 SW1.2), Interfaces (D14.2 J5.6)
UART_RX: SA818S (Q3.2 R32.2), MCU (J3.5 R68.1 U9.10)
UART_TX: SA818S (Q2.2 R31.2), MCU (J3.4 R56.1)

## Assembly variants
Normalni osazeni: not fitted R? R?